# EAGLE design Lipmouse_PCB (EAGLE 6.5.0)
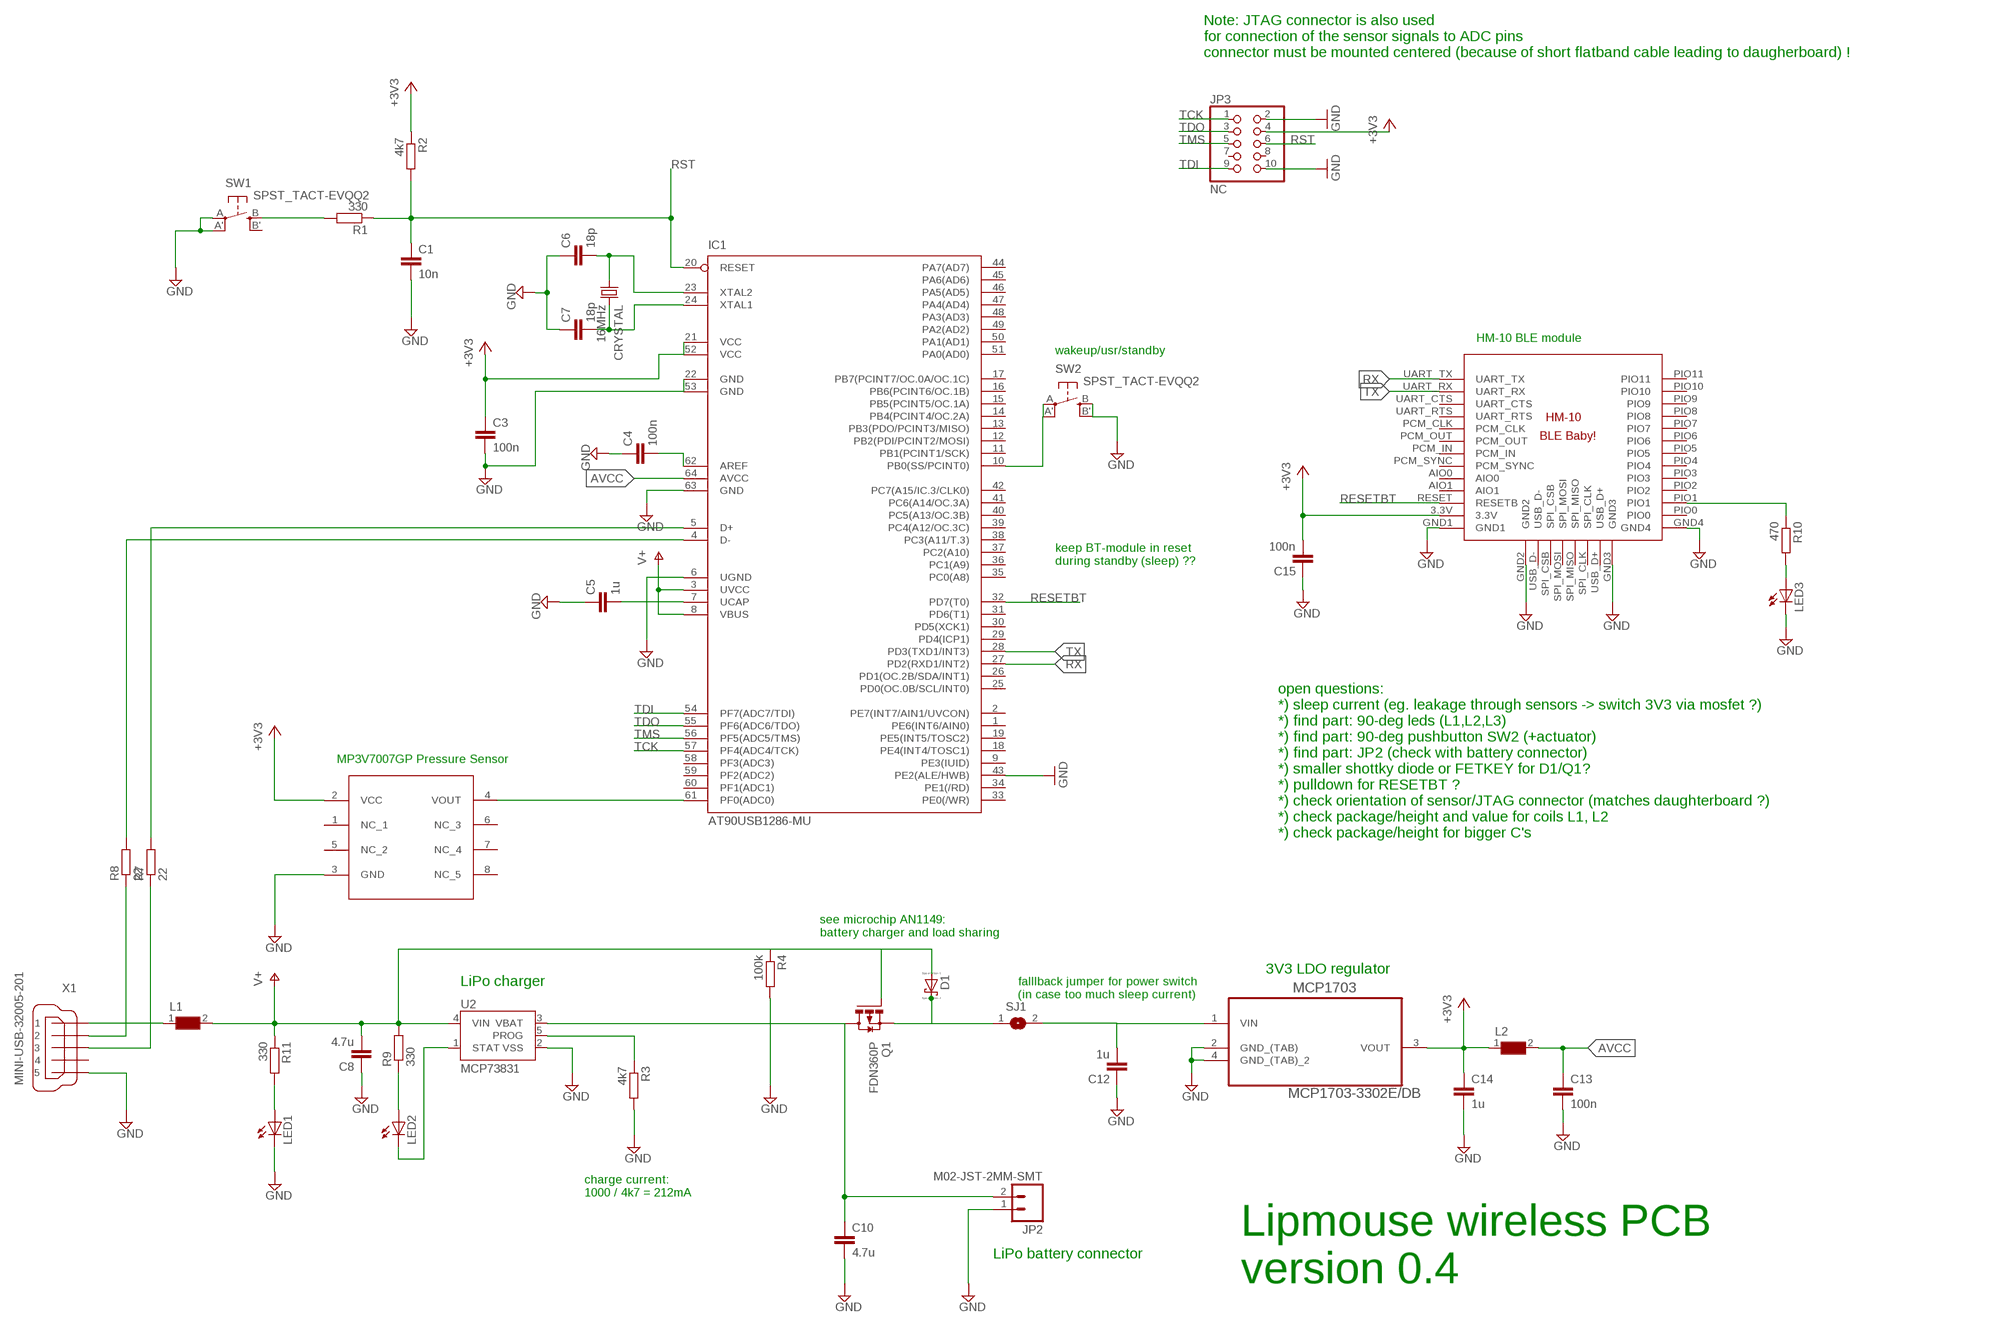
[diagram p0: schematic, sheet 1]

## Parts
C1  10n  C-EUC0603  [C0603]
C3  100n  C-EUC0603  [C0603]
C4  100n  C-EUC0603  [C0603]
C5  1u  C-EUC0603  [C0603]
C6  18p  C-EUC0603  [C0603]
C7  18p  C-EUC0603  [C0603]
C8  4.7u  C-EUC0805  [C0805]
C10  4.7u  C-EUC0805  [C0805]
C12  1u  C-EUC0603  [C0603]
C13  100n  C-EUC0603  [C0603]
C14  1u  C-EUC0603  [C0603]
C15  100n  C-EUC0603  [C0603]
CRYSTAL  16MHz  CRYSTALTXC-7A  [CRYSTAL-TXC-7A]
D1  SCHOTTKY-DIODE  [DIODE_SMB]
IC1  AT90USB1286-MU  AT90USB1287-AU  [TQFP64]
JP2  M02-JST-2MM-SMT  [JST-2-SMD]
JP3  NC  PINHD-2X5  [2X05]
L1  WE-CBF-74279201_0805  [0805]
L2  WE-CBF-74279201_0805  [0805]
LED1  LEDSMT1206  [1206]
LED2  LEDSMT1206  [1206]
LED3  LEDSMT1206  [1206]
MCP1703  MCP1703-3302E/DB  [SOT230P700X180-4N]
MP3V7007  MP3V7007GP  [SMP_MP3V7007]
Q1  FDN360P  [SUPER-SOT3]
R1  330  R-EU_R0603  [R0603]
R2  4k7  R-EU_R0603  [R0603]
R3  4k7  R-EU_R0603  [R0603]
R4  100k  R-EU_R0603  [R0603]
R7  22  R-EU_R0603  [R0603]
R8  22  R-EU_R0603  [R0603]
R9  330  R-EU_R0603  [R0603]
R10  470  R-EU_R0603  [R0603]
R11  330  R-EU_R0603  [R0603]
SJ1  SJ  [SJ]
SW1  SPST_TACT-EVQQ2  [EVQ-Q2]
SW2  SPST_TACT-EVQQ2  [EVQ-Q2]
U2  MCP73831  [SOT23-5]
U$1  BLE-HM-10  [BLE-HM-10]
X1  MINI-USB-32005-201  [32005-201]

## Nets
+3V3: C3.1 C14.1 C15.2 IC1.21(VCC) IC1.52(VCC) JP3.4 L2.1 MCP1703.3(VOUT) MP3V7007.2(VCC) R2.1 U$1.3.3V
AVCC: C13.1 IC1.64(AVCC) L2.2
D+: R7.1 X1.3
D-: R8.1 X1.2
GND: C1.2 C3.2 C4.1 C5.1 C6.1 C7.1 C8.1 C10.2 C12.1 C13.2 C14.2 C15.1 IC1.6(UGND) IC1.22(GND) IC1.43(PE2(ALE/HWB)) IC1.53(GND) IC1.63(GND) JP2.1 JP3.2 JP3.10 LED1.C LED3.C MCP1703.2(GND_(TAB)) MCP1703.4(GND_(TAB)_2) MP3V7007.3(GND) R3.2 R4.2 SW1.A'(P1) SW1.A(P) SW2.B'(S1) SW2.B(S) U2.2(VSS) U$1.GND1 U$1.GND2 U$1.GND3 U$1.GND4 X1.5
N$1: L1.1 X1.1
N$2: LED2.C U2.1(STAT)
N$3: C4.2 IC1.62(AREF)
N$4: C5.2 IC1.7(UCAP)
N$5: IC1.10(PB0(SS/PCINT0)) SW2.A'(P1) SW2.A(P)
N$6: R3.1 U2.5(PROG)
N$7: D1.C(A) Q1.2(S) SJ1.1
N$9: IC1.5(D+) R7.2
N$10: IC1.4(D-) R8.2
N$11: LED1.A R11.2
N$17: LED2.A R9.1
PF0: IC1.61(PF0(ADC0)) MP3V7007.4(VOUT)
PIO: R10.1 U$1.PIO1
PIO1: LED3.A R10.2
RESETBT: IC1.32(PD7(T0)) U$1.RESET(RESETB)
RST: C1.1 IC1.20(RESET) JP3.6 R1.1 R2.2
RX: IC1.27(PD2(RXD1/INT2)) U$1.UART_TX
SW1: R1.2 SW1.B(S)
TCK: IC1.57(PF4(ADC4/TCK)) JP3.1
TDI: IC1.54(PF7(ADC7/TDI)) JP3.9
TDO: IC1.55(PF6(ADC6/TDO)) JP3.3
TMS: IC1.56(PF5(ADC5/TMS)) JP3.5
TX: IC1.28(PD3(TXD1/INT3)) U$1.UART_RX
V+: C8.2 D1.A(C) IC1.3(UVCC) IC1.8(VBUS) L1.2 Q1.1(G) R4.1 R9.2 R11.1 U2.4(VIN)
VBAT: C10.1 JP2.2 Q1.3(D) U2.3(VBAT)
VSYS: C12.2 MCP1703.1(VIN) SJ1.2
XTAL1: C6.2 CRYSTAL.P$1 IC1.23(XTAL2)
XTAL2: C7.2 CRYSTAL.P$2 IC1.24(XTAL1)
Unconnected: IC1.1(PE6(INT6/AIN0)) IC1.2(PE7(INT7/AIN1/UVCON)) IC1.9(PE3(IUID)) IC1.11(PB1(PCINT1/SCK)) IC1.12(PB2(PDI/PCINT2/MOSI)) IC1.13(PB3(PDO/PCINT3/MISO)) IC1.14(PB4(PCINT4/OC.2A)) IC1.15(PB5(PCINT5/OC.1A)) IC1.16(PB6(PCINT6/OC.1B)) IC1.17(PB7(PCINT7/OC.0A/OC.1C)) IC1.18(PE4(INT4/TOSC1)) IC1.19(PE5(INT5/TOSC2)) IC1.25(PD0(OC.0B/SCL/INT0)) IC1.26(PD1(OC.2B/SDA/INT1)) IC1.29(PD4(ICP1)) IC1.30(PD5(XCK1)) IC1.31(PD6(T1)) IC1.33(PE0(/WR)) IC1.34(PE1(/RD)) IC1.35(PC0(A8)) IC1.36(PC1(A9)) IC1.37(PC2(A10)) IC1.38(PC3(A11/T.3)) IC1.39(PC4(A12/OC.3C)) IC1.40(PC5(A13/OC.3B)) IC1.41(PC6(A14/OC.3A)) IC1.42(PC7(A15/IC.3/CLK0)) IC1.44(PA7(AD7)) IC1.45(PA6(AD6)) IC1.46(PA5(AD5)) IC1.47(PA4(AD4)) IC1.48(PA3(AD3)) IC1.49(PA2(AD2)) IC1.50(PA1(AD1)) IC1.51(PA0(AD0)) IC1.58(PF3(ADC3)) IC1.59(PF2(ADC2)) IC1.60(PF1(ADC1)) JP3.7 JP3.8 MP3V7007.1(NC_1) MP3V7007.5(NC_2) MP3V7007.6(NC_3) MP3V7007.7(NC_4) MP3V7007.8(NC_5) SW1.B'(S1) U$1.AIO0 U$1.AIO1 U$1.PCM_CLK U$1.PCM_IN U$1.PCM_OUT U$1.PCM_SYNC U$1.PIO0 U$1.PIO2 U$1.PIO3 U$1.PIO4 U$1.PIO5 U$1.PIO6 U$1.PIO7 U$1.PIO8 U$1.PIO9 U$1.PIO10 U$1.PIO11 U$1.SPI_CLK U$1.SPI_CSB U$1.SPI_MISO U$1.SPI_MOSI U$1.UART_CTS U$1.UART_RTS U$1.USB_D+ U$1.USB_D- X1.4

## Notes on the sheet
- Note: JTAG connector is also used 
  for connection of the sensor signals to ADC pins 
  connector must be mounted centered (because of short flatband cable leading to daugherboard) !
- HM-10 BLE module
- wakeup/usr/standby
- keep BT-module in reset 
  during standby (sleep) ??
- MP3V7007GP Pressure Sensor
- open questions:
  *) sleep current (eg. leakage through sensors -> switch 3V3 via mosfet ?)
  *) find part: 90-deg leds (L1,L2,L3) 
  *) find part: 90-deg pushbutton SW2 (+actuator) 
  *) find part: JP2 (check with battery connector)
  *) smaller shottky diode or FETKEY for D1/Q1?
  *) pulldown for RESETBT ?
  *) check orientation of sensor/JTAG connector (matches daughterboard ?)
  *) check package/height and value for coils L1, L2
  *) check package/height for bigger C's
- see microchip AN1149: 
  battery charger and load sharing
- 3V3 LDO regulator
- LiPo charger
- falllback jumper for power switch
  (in case too much sleep current)
- charge current:
  1000 / 4k7 = 212mA
- LiPo battery connector
- Lipmouse wireless PCB
  version 0.4

## Library data of the parts
C1 C3-C8 C10 C12-C15 = resistor:C-EU: CAPACITOR, European symbol
CRYSTAL = SparkFun-FreqCtrl:CRYSTAL: Various standard crystals. Proven footprints. Spark Fun Electronics SKU : COM-00534
D1 = eagle-ltspice:SCHOTTKY-DIODE: Schottky Diode; SPICEMODEL: NONE; SPICEPREFIX: D; SPICETYPE: diode
IC1 = Sensorboard:AT90USB1287-*: Atmel AT90USB1287 AVR Microcontroller with USB Interface and 128kB Flash Memory
JP2 = SparkFun-Connectors:M02: Standard 2-pin 0.1" header. Use with - straight break away headers ( PRT-00116) - right angle break away headers (PRT-00553) - swiss pins (PRT-00743) - machine pins (PRT-00117) - female headers (PRT-00115) Molex polarized connector foot print use with: PRT-08233 with associated crimp pins and housings. 2.54_SCREWTERM for use with PRT-10571. 3.5mm Screw Terminal footprints for PRT-08084 5mm Screw Terminal footprints for use with PRT-08433; PROD_ID: CONN-08352
JP3 = pinhead:PINHD-2X5: PIN HEADER
L1 L2 = WE-CBF:WE-CBF: SMD EMI Suppression Ferrite Beads WE-CBF - Excellent anti-EMI properties - Low DC-restistance - Impedances till 3000 ohms - Rated current up to 6 A -- Reliable Ni-Sn electrodes -- Perfect as data lined filter and for uncoupling of distribution voltage; MPN: 74279201; OC_FARNELL: 1635708; OC_NEWARK: 08P2359; PACKAGE: IND-0805; SUPPLIER: Wuerth Elektronik
LED1-LED3 = led:LED: LED OSRAM: - CHIPLED LG R971, LG N971, LY N971, LG Q971, LY Q971, LO R971, LY R971 LH N974, LH R974 LS Q976, LO Q976, LY Q976 LO Q996 - Hyper CHIPLED LW Q18S LB Q993, LB Q99A, LB R99A - SideLED LS A670, LO A670, LY A670, LG A670, LP A670 LB A673, LV A673, LT A673, LW A673 LH A674 LY A675 LS A676, LA A676, LO A676, LY A676, LW A676 LS A679, LY A679, LG A679 - Hyper Micro SIDELED® LS Y876, LA Y876, LO Y876, LY Y876 LT Y87S - SmartLED LW L88C, LW L88S LB L89C, LB L89S, LG L890 LS L89K, LO L89K, LY L89K LS L896, LA L896, LO L896, LY L896 - TOPLED LS T670, LO T670, LY T670, LG T670, LP T670 LSG T670, LSP T670, LSY T670, LOP T670, LYG T670 LG T671, LOG T671, LSG T671 LB T673, LV T673, LT T673, LW T673 LH T674 LS T676, LA T676, LO T676, LY T676, LB T676, LH T676, LSB T676, LW T676 LB T67C, LV T67C, LT T67C, LS T67K, LO T67K, LY T67K, LW E67C LS E67B, LA E67B, LO E67B, LY E67B, LB E67C, LV E67C, LT E67C LW T67C LS T679, LY T679, LG T679 LS T770, LO T770, LY T770, LG T770, LP T770 LB T773, LV T773, LT T773, LW T773 LH T774 LS E675, LA E675, LY E675, LS T675 LS T776, LA T776, LO T776, LY T776, LB T776 LHGB T686 LT T68C, LB T68C - Hyper Mini TOPLED® LB M676 - Mini TOPLED Santana® LG M470 LS M47K, LO M47K, LY M47K Source: http://www.osram.convergy.de LUXEON: - LUMILED® LXK2-PW12-R00, LXK2-PW12-S00, LXK2-PW14-U00, LXK2-PW14-V00 LXK2-PM12-R00, LXK2-PM12-S00, LXK2-PM14-U00 LXK2-PE12-Q00, LXK2-PE12-R00, LXK2-PE12-S00, LXK2-PE14-T00, LXK2-PE14-U00 LXK2-PB12-K00, LXK2-PB12-L00, LXK2-PB12-M00, LXK2-PB14-N00, LXK2-PB14-P00, LXK2-PB14-Q00 LXK2-PR12-L00, LXK2-PR12-M00, LXK2-PR14-Q00, LXK2-PR14-R00 LXK2-PD12-Q00, LXK2-PD12-R00, LXK2-PD12-S00 LXK2-PH12-R00, LXK2-PH12-S00 LXK2-PL12-P00, LXK2-PL12-Q00, LXK2-PL12-R00 Source: www.luxeon.com KINGBRIGHT: KA-3528ASYC Source: www.kingbright.com
MCP1703 = Microchip_By_element14_Batch_1:MCP1703-3302E/DB: IC REG LDO 3.3V 250MA; MPN: MCP1703-3302E/DB; OC_FARNELL: 1627177; OC_NEWARK: 40M0623; PACKAGE: SOT-223-3; SUPPLIER: Microchip
MP3V7007 = my_own_designs:MP3V7007GP
Q1 = transistor-power:FDN360P: Single P-Channel, PowerTrench (R) MOSFET Source: http://www.fairchildsemi.com/ds/FD/FDN360P.pdf
R1-R4 R7-R11 = resistor:R-EU_: RESISTOR, European symbol
SJ1 = jumper:SJ: SMD solder JUMPER
SW1 SW2 = adafruit:SPST_TACT: SMT 6mm switch, EVQQ2 series http://www.ladyada.net/library/eagle
U2 = SparkFun:MCP73831: Microchip's MCP73831 Miniature single cell, fully integrated Li-Ion, Li-polymer charge management controller http://ww1.microchip.com/downloads/en/DeviceDoc/21984a.pdf
U$1 = Random parts:BLE-HM-10
X1 = con-cypressindustries:MINI-USB-: MINI USB-B Conector Source: www.cypressindustries.com; OC_FARNELL: unknown; OC_NEWARK: unknown

## Board
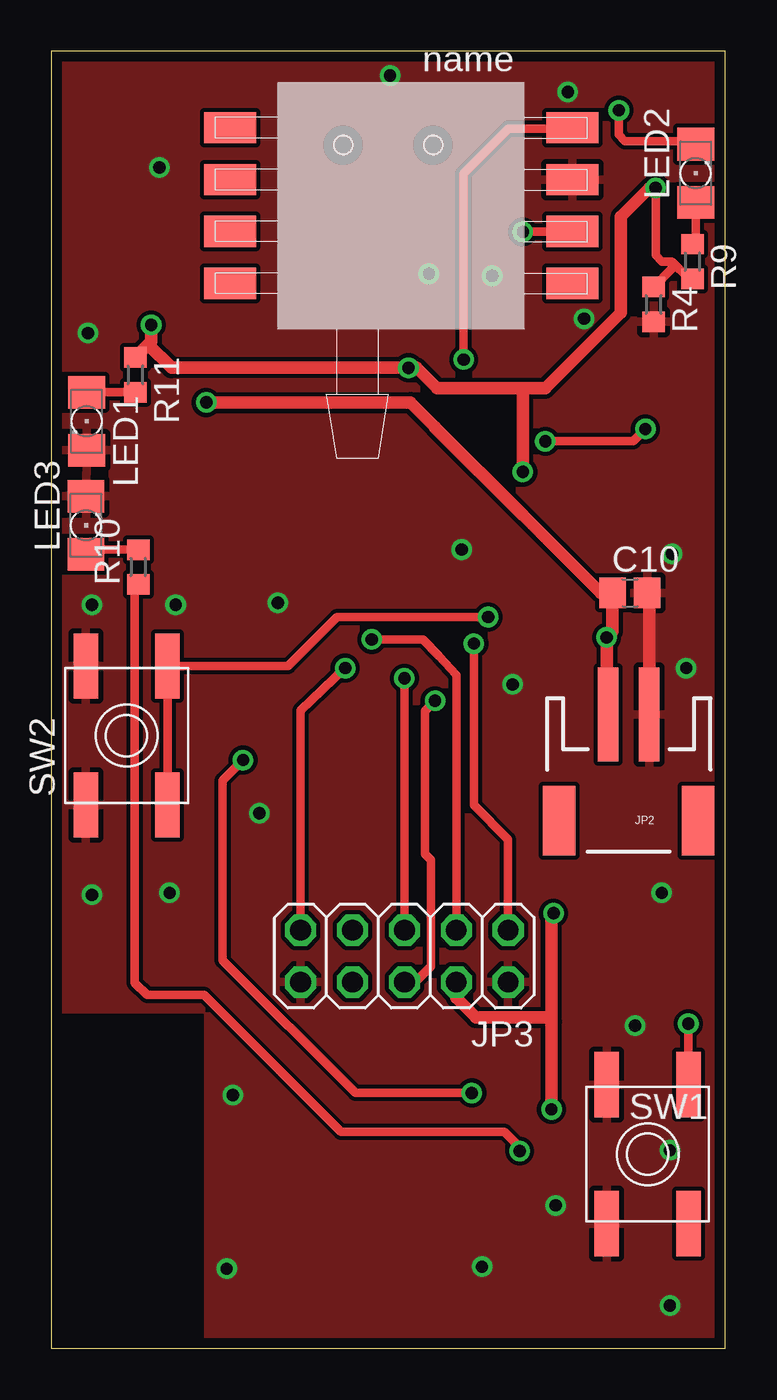
[diagram p1: board, top side]
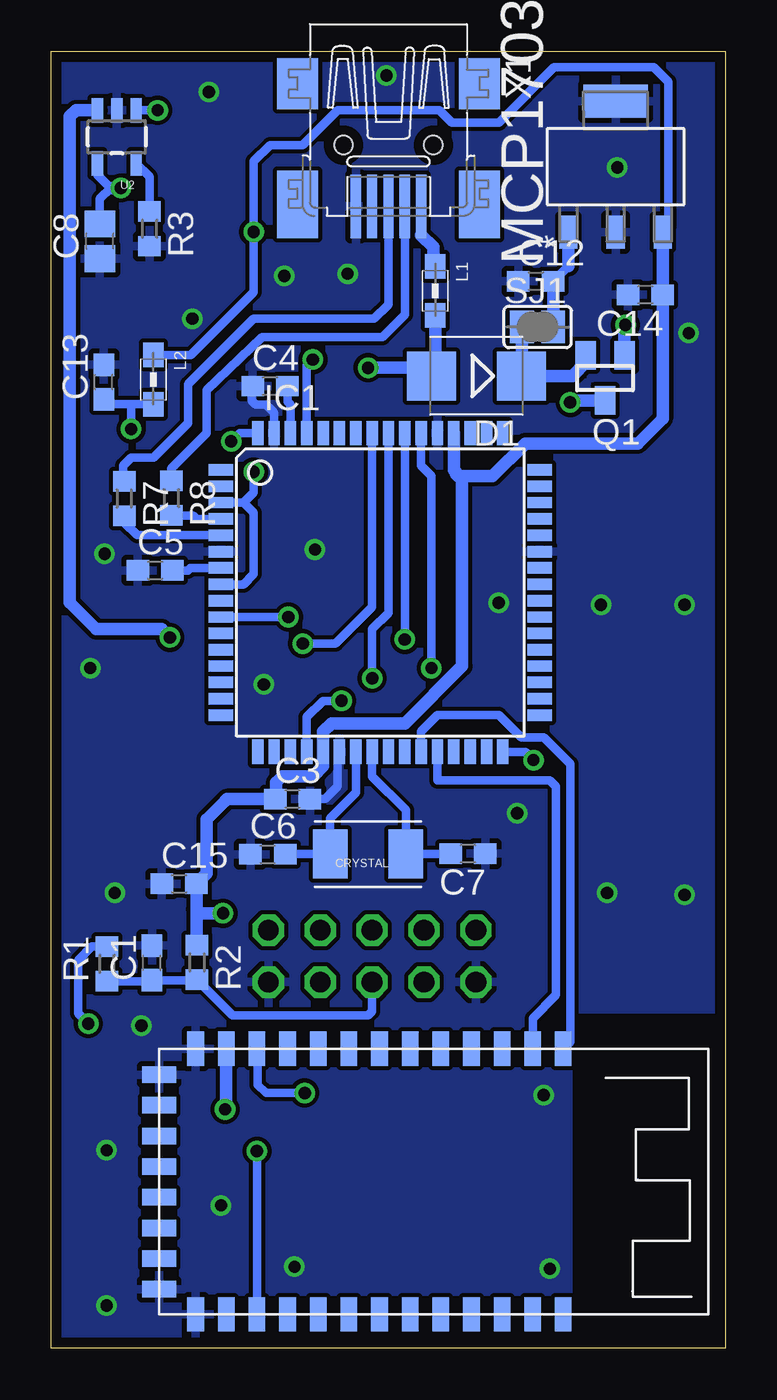
[diagram p2: board, bottom side, seen from below]

Size 33.02 x 63.5 mm. Coordinates in mm from the lower left corner, seen from the top.
Outline: 0,0 33.02,0 33.02,63.5 0,63.5 0,0
Copper layers (1*16): Top 0.035mm / dielectric 1.5mm / Bottom 0.035mm
Design rules "default *": minimum track width 10mil, minimum drill 20mil, track to track 8mil, track to pad 8mil, pad to pad 8mil, via to via 8mil, smd to smd 8mil, copper to edge 20mil, drill to drill 8mil, minimum pad ring 10mil, minimum via ring 8mil, stop-mask expansion 4mil, vias tented up to drill 0mil, thermal gap 10mil

### Footprints (pad centres in the part's own frame; a part is rotated, then mirrored left to right if it is on the bottom)
C0603 = smd 1.1 x 1: 1 -0.85,0; 2 0.85,0
C0805 = smd 1.3 x 1.5: 1 -0.85,0; 2 0.85,0
CRYSTAL-TXC-7A = smd 1.7 x 2.4: P$1 1.85,0; P$2 -1.85,0
DIODE_SMB = smd 2.4 x 2.4: A 2.2,0; C -2.2,0
TQFP64 = smd 1.194 x 0.559: 1 -7.8,6; 2 -7.8,5.2; 3 -7.8,4.4; 4 -7.8,3.6; 5 -7.8,2.8; 6 -7.8,2; 7 -7.8,1.2; 8 -7.8,0.4; 9 -7.8,-0.4; 10 -7.8,-1.2; 11 -7.8,-2; 12 -7.8,-2.8; 13 -7.8,-3.6; 14 -7.8,-4.4; 15 -7.8,-5.2; 16 -7.8,-6; 33 7.8,-6; 34 7.8,-5.2; 35 7.8,-4.4; 36 7.8,-3.6; 37 7.8,-2.8; 38 7.8,-2; 39 7.8,-1.2; 40 7.8,-0.4; 41 7.8,0.4; 42 7.8,1.2; 43 7.8,2; 44 7.8,2.8; 45 7.8,3.6; 46 7.8,4.4; 47 7.8,5.2; 48 7.8,6 | smd 0.559 x 1.194: 17 -6,-7.8; 18 -5.2,-7.8; 19 -4.4,-7.8; 20 -3.6,-7.8; 21 -2.8,-7.8; 22 -2,-7.8; 23 -1.2,-7.8; 24 -0.4,-7.8; 25 0.4,-7.8; 26 1.2,-7.8; 27 2,-7.8; 28 2.8,-7.8; 29 3.6,-7.8; 30 4.4,-7.8; 31 5.2,-7.8; 32 6,-7.8; 49 6,7.8; 50 5.2,7.8; 51 4.4,7.8; 52 3.6,7.8; 53 2.8,7.8; 54 2,7.8; 55 1.2,7.8; 56 0.4,7.8; 57 -0.4,7.8; 58 -1.2,7.8; 59 -2,7.8; 60 -2.8,7.8; 61 -3.6,7.8; 62 -4.4,7.8; 63 -5.2,7.8; 64 -6,7.8
JST-2-SMD = smd 1 x 4.6: 1 -1,-3.7; 2 1,-3.7 | smd 1.6 x 3.4: NC1 -3.4,1.5; NC2 3.4,1.5
2X05 = drill 1.016 octagon: 1 -5.08,-1.27; 2 -5.08,1.27; 3 -2.54,-1.27; 4 -2.54,1.27; 5 0,-1.27; 6 0,1.27; 7 2.54,-1.27; 8 2.54,1.27; 9 5.08,-1.27; 10 5.08,1.27
0805 = smd 1.2 x 1: 1 -1.2,0; 2 1.2,0
1206 = smd 1.6 x 1.803: A -1.422,0; C 1.422,0
SOT230P700X180-4N = smd 1.626 x 0.889: 1 -3.2,2.311; 2 -3.2,0; 3 -3.2,-2.311 | smd 1.626 x 3.175: 4 3.2,0
SMP_MP3V7007 = smd 2.54 x 1.524: 1 8.382,-3.81; 2 8.382,-1.27; 3 8.382,1.27; 4 8.382,3.81; 5 -8.382,3.81; 6 -8.382,1.27; 7 -8.382,-1.27; 8 -8.382,-3.81
SUPER-SOT3 = smd 1 x 1.4: 1 -0.95,-1.1; 2 0.95,-1.1; 3 0,1.1
R0603 = smd 1 x 1.1: 1 -0.85,0; 2 0.85,0
SJ = smd 1.168 x 1.6: 1 -0.762,0; 2 0.762,0
EVQ-Q2 = smd 3.2 x 1.2: A -3.4,-2; A' 3.4,-2; B -3.4,2; B' 3.4,2
SOT23-5 = smd 0.55 x 1.2: 1 -0.95,-1.3; 2 0,-1.3; 3 0.95,-1.3; 4 0.95,1.3; 5 -0.95,1.3
BLE-HM-10 = smd 1.676 x 0.813: 3.3V 0,3.29; AIO0 0,7.79; AIO1 0,6.29; GND1 0,1.79; GND4 13,1.79; PCM_CLK 0,13.79; PCM_IN 0,10.79; PCM_OUT 0,12.29; PCM_SYNC 0,9.29; PIO0 13,3.29; PIO1 13,4.79; PIO2 13,6.29; PIO3 13,7.79; PIO4 13,9.29; PIO5 13,10.79; PIO6 13,12.29; PIO7 13,13.79; PIO8 13,15.29; PIO9 13,16.79; PIO10 13,18.29; PIO11 13,19.79; RESET 0,4.79; UART_CTS 0,16.79; UART_RTS 0,15.29; UART_RX 0,18.29; UART_TX 0,19.79 | smd 0.813 x 1.676: GND2 1.27,0; GND3 11.77,0; SPI_CLK 8.77,0; SPI_CSB 4.27,0; SPI_MISO 7.27,0; SPI_MOSI 5.77,0; USB_D+ 10.27,0; USB_D- 2.77,0
32005-201 = smd 3.1 x 0.5: 1 3,1.6; 2 3,0.8; 3 3,0; 4 3,-0.8; 5 3,-1.6 | smd 2.5 x 2: M1 -3,-4.45; M2 -3,4.45 | smd 3.3 x 2: M3 2.9,4.45; M4 2.9,-4.45 | hole 0.9: 0,2.2; 0,-2.2

### Placement (x,y rotation side)
C1  28.08,18.87 90 bottom
C3  21.2,26.89 0 bottom
C4  22.3,47.1 0 bottom
C5  27.92,38.08 0 bottom
C6  22.41,24.18 0 bottom
C7  12.61,24.22 180 bottom
C8  30.63,54.19 90 bottom
C10  28.34,36.98 0 top
C12  9.29,52.23 0 bottom
C13  30.44,47.3 90 bottom
C14  3.93,51.57 180 bottom
C15  26.75,22.74 0 bottom
CRYSTAL  17.5,24.2 180 bottom
D1  12.2,47.6 180 bottom
IC1  16.9,37 0 bottom
JP2  28.28,27.32 180 top
JP3  17.3,19.2 180 top
L1  14.21,51.76 270 bottom
L2  28.01,47.42 270 bottom
LED1  1.74,45.38 270 top
LED2  31.56,57.52 90 top
LED3  1.71,40.29 90 top
MCP1703  5.38,57.84 90 bottom
MP3V7007  17.14,55.94 0 top
Q1  5.9,47.5 180 bottom
R1  30.28,18.82 90 bottom
R2  25.87,18.89 270 bottom
R3  28.2,54.8 270 bottom
R4  29.5,51.1 270 top
R7  29.43,41.6 270 bottom
R8  27.13,41.62 270 bottom
R9  31.4,53.2 270 top
R10  4.27,38.25 90 top
R11  4.13,47.65 270 top
SJ1  9.2,50 0 bottom
SW1  29.21,9.51 270 top
SW2  3.7,30 90 top
U2  29.8,59.3 180 bottom
U$1  27.73,14.67 270 bottom
X1  16.5,58.9 270 bottom

### Tracks (layer width: path | path; a pad name or v marks a point on that pad's centre or on a via)
+3V3  (via drill 0.6)
  Top 0.406: MP3V7007.2 24.23,54.67 v23.1,54.65 | 24.5,21.2 v24.6,21.3 | 24.3,16.2 24.5,16
  Top 0.61: v24.5,11.7 24.5,16 24.5,21.2 | JP3.4 19.84,17.16 20.8,16.2 24.3,16.2
  Bottom 0.406: 25.9,19.77 R2.1 | 3.07,51.58 C14.1 | 13.2,42.8 13.2,42.9 | MCP1703.3 2.8,54.91 2.8,62 3.5,62.7 8.4,62.7 11.1,60 13.4,60 14,60.6 19,60.6 20.7,58.9 22.3,58.9 23.1,58.1 v23.1,54.65 23.1,51.7 26.18,48.62 L2.1 | 12.9,42.6 12.8,42.7 | 24.44,11.76 v24.5,11.7 | 25.7,21.3 25.9,21.5 | 24.41,26.89 24.51,26.79 | 22,26.94 C3.1
  Bottom 0.61: 24.51,26.79 25.4,25.9 25.4,23.24 C15.2 25.9,21.5 25.9,19.77 | MCP1703.3 3.07,51.58 | C14.1 3.08,45.52 4.3,44.3 9.8,44.3 11.4,42.7 12.8,42.7 13.1,42.7 13.2,42.8 | 13.2,42.9 13.3,43 IC1.52 | 12.9,42.6 12.9,33.4 15.7,30.6 19.3,30.6 19.7,30.2 IC1.21 19.7,28.5 20.2,28 21.7,28 22,27.7 22,26.94 | U$1.3.3V 24.44,11.76 | v24.6,21.3 25.7,21.3 | C3.1 24.41,26.89
AVCC  (via drill 0.6)
  Top 0.406: v24.2,44.4 28.5,44.4 v29.1,45
  Bottom 0.406: L2.2 29,46.22 | 29,46.22 30.21,46.22 C13.1 | IC1.64 23.8,44.8 v24.2,44.4 | v29.1,45 29.1,46.12 29,46.22
D+
  Bottom 0.406: X1.3 16.5,51.1 17.2,50.4 23.1,50.4 26.3,47.2 26.3,45.3 28,43.6 29.1,43.6 29.5,43.2 29.5,42.52 R7.1
D-
  Bottom 0.406: R8.1 27.13,43.07 25.4,44.8 25.4,46.9 22.7,49.5 16.8,49.5 15.7,50.6 X1.2
GND  (via drill 0.6)
  Top 0.61: JP2.1 29.28,36.89 C10.2
  Bottom 0.406: IC1.22 19,29.1 19,27.5 19.61,26.89 C3.2 | IC1.63 22.1,45.8 22.5,46.2 23,46.2 23.2,46.4 23.2,47.05 C4.1
  other vias: 25.3,61.5 5.3,57.8 1.8,49.7 18.5,52.6 16.6,62.3 11.1,36.5 6.1,36.4 20.1,39.1 30.4,38.9 22.6,32.5 10.2,26.2 29.9,22.3 28.6,15.8 30.3,9.7 30.3,2.1 21.1,4 8.6,3.9 8.9,12.4 24.7,7 26.1,50.4 21.6,52.5 2,36.4 5.8,22.3 2,22.2 31.1,33.3
  pour Top: 0,63.5 33.02,63.5 33.02,0 7.7,-0.1 7.7,16.6 0,16.6
  pour Bottom: 0,63.5 33.02,63.5 33.02,0 7.7,-0.1 7.7,16.6 0,16.6
N$1
  Bottom 0.406: X1.1 14.9,54.5 | 14.3,53.05 L1.1
  Bottom 0.61: 14.9,54.5 14.3,53.9 14.3,53.05
N$2  (via drill 0.6)
  Top 0.406: v27.8,60.6 27.8,59.4 28.1,59.1 31.4,59.1 LED2.C
  Bottom 0.406: U2.1 v27.8,60.6 | v27.8,60.6
N$3
  Bottom 0.406: C4.2 21.45,46.35 21.3,46.2 IC1.62
N$4
  Bottom 0.406: IC1.7 26.2,38.2 26.32,38.08 C5.2
N$5  (via drill 0.6)
  Top 0.406: SW2.A SW2.A' 11.6,33.4 14,35.8 v21.4,35.8
  Bottom 0.406: v21.4,35.8 IC1.10
N$6
  Bottom 0.406: R3.1 28.2,57.35 U2.5
N$7
  Bottom 0.406: 9.96,47.64 D1.C | Q1.2 6.85,48.25
  Bottom 0.61: SJ1.1 9.96,47.64 | 6.85,48.25 7.5,47.6 D1.C
N$9
  Bottom 0.406: IC1.5 28.8,39.8 29.43,40.43 R7.2
N$10
  Bottom 0.406: IC1.4 25.9,40.6 26.07,40.77 R8.2
N$11
  Top 0.406: R11.2 LED1.A
N$17
  Top 0.406: LED2.A 31.56,54.21 R9.1
PF0  (via drill 0.6)
  Top 0.406: v20.2,48.4 20.2,57.5 22.4,59.7 25.47,59.7 MP3V7007.4
  Bottom 0.406: IC1.61 20.5,48.1 v20.2,48.4
PIO  (via drill 0.6)
  Top 0.406: R10.1 4.1,37.23 4.1,17.9 4.7,17.3 7.5,17.3 14.2,10.6 22.2,10.6 22.94,9.86 v22.94,9.66
  Bottom 0.406: U$1.PIO1 v22.94,9.66
PIO1
  Top 0.406: R10.2 1.94,39.1 LED3.A
RESETBT  (via drill 0.6)
  Top 0.406: v9.4,28.8 8.4,27.8 8.4,19 14.9,12.5 v20.6,12.5
  Bottom 0.406: IC1.32 9.8,29.2 v9.4,28.8 | v20.6,12.5 22.5,12.5 22.9,12.9 22.9,14.63 U$1.RESET
RST  (via drill 0.6)
  Top 0.406: v18.8,31.7 18.3,31.2 18.3,24.2 18.6,23.9 18.6,18.7 17.83,17.93 JP3.6
  Bottom 0.406: IC1.20 20.5,30.9 19.7,31.7 v18.8,31.7 | JP3.6 17.3,16.5 17.5,16.3 22.91,16.3 24.13,16.3 R2.2 25.89,18.02 C1.1 28.13,17.97 R1.1
RX
  Bottom 0.406: U$1.UART_TX 7.6,15.01 7.6,28.6 8.9,29.9 10,29.9 11.1,31 14.1,31 14.9,30.2 IC1.27
SW1  (via drill 0.6)
  Top 0.406: SW1.B v31.2,15.9
  Bottom 0.406: v31.2,15.9 31.7,16.4 31.7,19 31.03,19.67 R1.2
TCK  (via drill 0.6)
  Top 0.406: v20.7,34.5 20.7,26.6 22.38,24.92 JP3.1
  Bottom 0.406: IC1.57 17.3,36.3 19.1,34.5 v20.7,34.5
TDI  (via drill 0.6)
  Top 0.406: v14.4,33.3 12.22,31.22 JP3.9
  Bottom 0.406: IC1.54 14.9,43.2 14.4,42.7 v14.4,33.3
TDO  (via drill 0.6)
  Top 0.406: v15.7,34.7 18.2,34.7 19,33.9 19.84,32.96 JP3.3
  Bottom 0.406: IC1.55 v15.7,34.7
TMS  (via drill 0.6)
  Top 0.406: v17.3,32.8 JP3.5
  Bottom 0.406: IC1.56 16.5,36 17.3,35.2 v17.3,32.8
TX
  Bottom 0.406: IC1.28 14.1,27.8 8.6,27.8 8.3,27.5 8.3,17.3 9.44,16.16 U$1.UART_RX
V+  (via drill 0.6)
  Top 0.406: 29.3,56.8 v29.6,56.8 29.6,53.5 29.9,53.2 30.4,53.2 | R9.2 31.25,52.35 30.4,53.2 | 4.9,49.27 4.76,49.13 | 30.4,53.2 30.4,52.85 R4.1
  Top 0.61: 23.1,47 18.9,47 17.9,48 v17.5,48 5.9,48 4.76,49.13 R11.1 | 23.1,47 24.2,47 27.9,50.7 27.9,55.4 29.3,56.8 | v4.9,50.1 4.9,49.27 | v23.1,42.9 23.1,47
  Bottom 0.406: IC1.8 23.6,37.4 23.1,37.9 23.1,40.9 23.6,41.4 | 23.7,41.4 IC1.3 23.6,41.4 | C8.2 30.63,56.27 30.1,56.8 30.75,57.45 U2.4 | 14.21,47.79 D1.A 15.2,47.6 15.6,48 | 4.95,50.05 v4.9,50.1 | 23.6,41.4 23.1,41.9 v23.1,42.9
  Bottom 0.61: v29.6,56.8 30.1,56.8 | L1.2 14.21,47.79 | 15.6,48 v17.5,48 | Q1.1 4.95,50.05
VBAT  (via drill 0.6)
  Top 0.406: 27.49,31.23 JP2.2
  Top 0.61: v7.6,46.3 17.6,46.3 18.8,45.1 18.8,45.07 23.1,40.8 26.92,36.98 C10.1 27.49,35.09 v27.2,34.8 27.2,31.1 JP2.2
  Bottom 0.406: v7.6,46.3 7.4,46.4
  Bottom 0.61: 7.4,46.4 Q1.3 | U2.3 31.8,60.6 32.1,60.3 32.1,36.5 30.8,35.2 27.6,35.2 v27.2,34.8 | U2.3
VSYS
  Bottom 0.406: 7.69,52.98 C12.2
  Bottom 0.61: MCP1703.1 7.69,52.98 | SJ1.2 C12.2
XTAL1
  Bottom 0.406: IC1.23 18.1,27.2 19.35,25.95 CRYSTAL.P$1 21.54,24.2 C6.2
XTAL2
  Bottom 0.406: IC1.24 17.3,28 15.65,26.35 CRYSTAL.P$2 13.48,24.2 C7.2